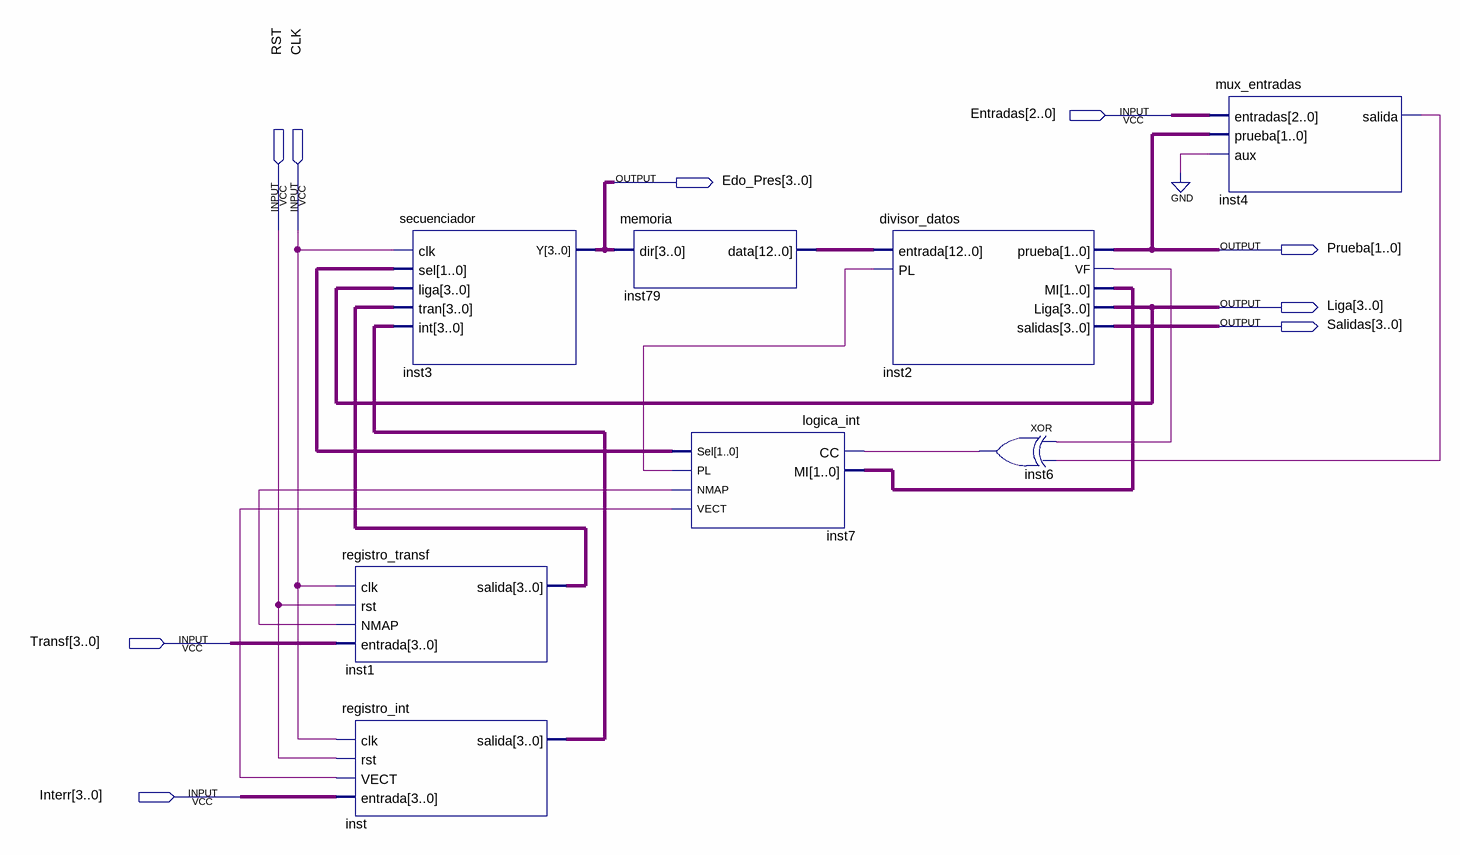
[diagram p0: schematic sheet]
// Quartus schematic practica6.bdf as structural Verilog: 8 symbols, 9 pins
module practica6 (
  input  [2:0] Entradas,
  input  RST,
  input  CLK,
  input  [3:0] Transf,
  input  [3:0] Interr,
  output [3:0] Edo_Pres,
  output [1:0] Prueba,
  output [3:0] Liga,
  output [3:0] Salidas
);

  wire inst2_vf, inst4_salida, inst6_out, inst7_nmap, inst7_pl, inst7_vect;
  wire [1:0] inst2_mi, inst7_sel;
  wire [3:0] inst1_salida, inst_salida;
  wire [12:0] inst79_data;

  registro_transf inst1 (.clk(CLK), .rst(RST), .NMAP(inst7_nmap), .entrada(Transf), .salida(inst1_salida));
  registro_int inst (.clk(CLK), .rst(RST), .VECT(inst7_vect), .entrada(Interr), .salida(inst_salida));
  secuenciador inst3 (
    .clk(CLK), .sel(inst7_sel), .liga(Liga), .\tran (inst1_salida), .\int (inst_salida), .Y(Edo_Pres));
  memoria inst79 (.dir(Edo_Pres), .data(inst79_data));
  logica_int inst7 (
    .CC(inst6_out), .MI(inst2_mi), .Sel(inst7_sel), .PL(inst7_pl), .NMAP(inst7_nmap), .VECT(inst7_vect));
  divisor_datos inst2 (
    .entrada(inst79_data), .PL(inst7_pl), .prueba(Prueba), .VF(inst2_vf), .MI(inst2_mi), .Liga(Liga),
    .salidas(Salidas));
  xor inst6 (inst6_out, inst2_vf, inst4_salida);
  mux_entradas inst4 (.entradas(Entradas), .prueba(Prueba), .aux(1'b0), .salida(inst4_salida));
endmodule
